# Altium schematic sheet robot-arm.SchDoc
size A; SheetNumber: 1; SheetTotal: 2
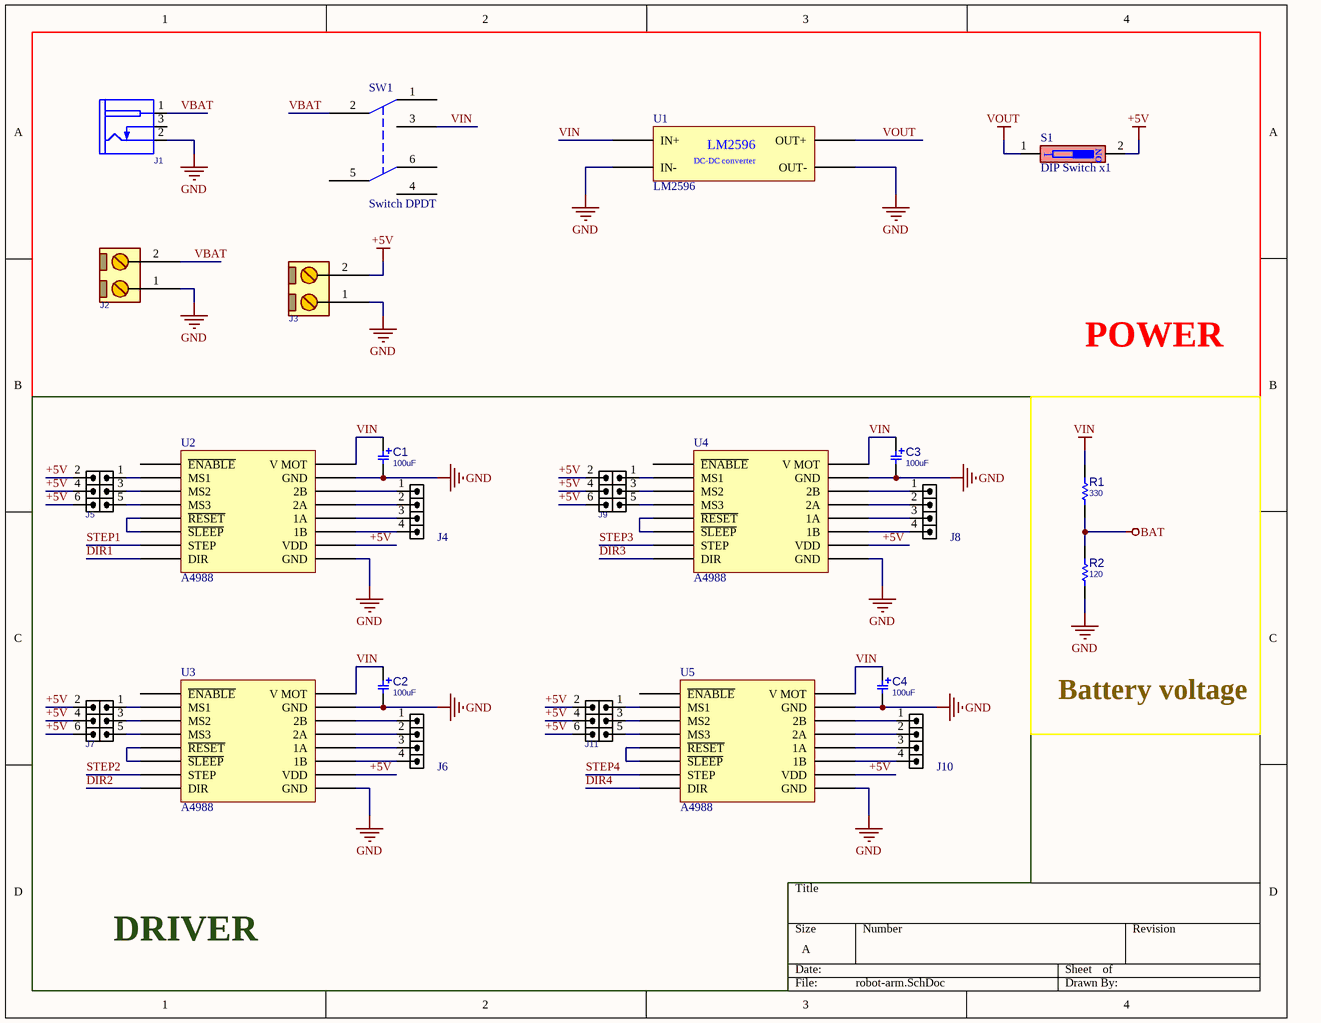
[diagram p0: robot-arm.SchDoc]

## Parts
C1  100uF  [C_EL_6X11]
C2  100uF  [C_EL_6X11]
C3  100uF  [C_EL_6X11]
C4  100uF  [C_EL_6X11]
J1  DC_POWER_JACK  [JAC_PWR2MM]  (value not drawn)
J2  CONN_TB2  [TBB_2]  (value not drawn)
J3  CONN_TB2  [TBB_2]  (value not drawn)
J4  HDR1X4  [HDR_M_1X4]  (value not drawn)
J5  HDRM_2X3  [HDR_M_2X3]  (value not drawn)
J6  HDR1X4  [HDR_M_1X4]  (value not drawn)
J7  HDRM_2X3  [HDR_M_2X3]  (value not drawn)
J8  HDR1X4  [HDR_M_1X4]  (value not drawn)
J9  HDRM_2X3  [HDR_M_2X3]  (value not drawn)
J10  HDR1X4  [HDR_M_1X4]  (value not drawn)
J11  HDRM_2X3  [HDR_M_2X3]  (value not drawn)
R1  330  [R025W_AX04]
R2  120  [R025W_AX04]
S1  DIP Switch x1  [DIP Switch x1]
SW1  Switch DPDT  [Switch DPDT]
U1  LM2596  [LM2596_MODULE]
U2  A4988  [DRIVER MOTOR_A4988]
U3  A4988  [DRIVER MOTOR_A4988]
U4  A4988  [DRIVER MOTOR_A4988]
U5  A4988  [DRIVER MOTOR_A4988]

## Blocks framed on the sheet
POWER: J1-J3 S1 SW1 U1
DRIVER: C1-C4 J4-J11 U2-U5
Battery voltage: R1 R2

## Nets
+5V: J3.2 J5.2 J5.4 J5.6 J7.2 J7.4 J7.6 J9.2 J9.4 J9.6 J11.2 J11.4 J11.6 S1.2 U2.10(VDD) U3.10(VDD) U4.10(VDD) U5.10(VDD)
BAT: R1.1 R2.2
GND: C1.2 C2.2 C3.2 C4.2 J1.2(SLEEVE) J2.1 J3.1 R2.1 U1.2(IN-) U1.3(OUT-) U2.9(GND) U2.15(GND) U3.9(GND) U3.15(GND) U4.9(GND) U4.15(GND) U5.9(GND) U5.15(GND)
VIN: C1.1 C2.1 C3.1 C4.1 R1.2 SW1.3 U1.1(IN+) U2.16(V_MOT) U3.16(V_MOT) U4.16(V_MOT) U5.16(V_MOT)
VOUT: S1.1 U1.4(OUT+)
DIR1: U2.8(DIR)
DIR2: U3.8(DIR)
DIR3: U4.8(DIR)
DIR4: U5.8(DIR)
STEP1: U2.7(STEP)
STEP2: U3.7(STEP)
STEP3: U4.7(STEP)
STEP4: U5.7(STEP)
VBAT: J1.1(TIP) J2.2 SW1.2
NetJ4_1: J4.1 U2.14(2B)
NetJ4_2: J4.2 U2.13(2A)
NetJ4_3: J4.3 U2.12(1A)
NetJ4_4: J4.4 U2.11(1B)
NetJ5_1: J5.1 U2.2(MS1)
NetJ5_3: J5.3 U2.3(MS2)
NetJ5_5: J5.5 U2.4(MS3)
NetJ6_1: J6.1 U3.14(2B)
NetJ6_2: J6.2 U3.13(2A)
NetJ6_3: J6.3 U3.12(1A)
NetJ6_4: J6.4 U3.11(1B)
NetJ7_1: J7.1 U3.2(MS1)
NetJ7_3: J7.3 U3.3(MS2)
NetJ7_5: J7.5 U3.4(MS3)
NetJ8_1: J8.1 U4.14(2B)
NetJ8_2: J8.2 U4.13(2A)
NetJ8_3: J8.3 U4.12(1A)
NetJ8_4: J8.4 U4.11(1B)
NetJ9_1: J9.1 U4.2(MS1)
NetJ9_3: J9.3 U4.3(MS2)
NetJ9_5: J9.5 U4.4(MS3)
NetJ10_1: J10.1 U5.14(2B)
NetJ10_2: J10.2 U5.13(2A)
NetJ10_3: J10.3 U5.12(1A)
NetJ10_4: J10.4 U5.11(1B)
NetJ11_1: J11.1 U5.2(MS1)
NetJ11_3: J11.3 U5.3(MS2)
NetJ11_5: J11.5 U5.4(MS3)
NetU2_5: U2.5(~{RESET}) U2.6(~{SLEEP})
NetU3_5: U3.5(~{RESET}) U3.6(~{SLEEP})
NetU4_5: U4.5(~{RESET}) U4.6(~{SLEEP})
NetU5_5: U5.5(~{RESET}) U5.6(~{SLEEP})

Not connected (* = marked no-connect by the designer): J1 3(INSERTION_DET); SW1 1 4 5 6; U2 1(~{ENABLE}); U3 1(~{ENABLE}); U4 1(~{ENABLE}); U5 1(~{ENABLE})

## Notes on the sheet
- (in symbol DIP Switch x1) ON

## Library data of the parts
C1-C4 = CAP_THD_EL: CAP, THD, ELEC,; MANF_P#: MANF_PART#; PARAM2: 20%; DESC: DESCRIPTION; DIST#: MOUSER; PARAM: 25V; PRICE: 10= 5$; MANF: MANF; ASSEMBLY: ASSEMBLY; VALUE: 100uF
J1 = CONN_PWR_JACK2MM: CONN, PWR JACK DC, PLUG DIAM 2.0MM RA THD; MANF: CUI STACK; MANF_P#: PJ-202A, PJ-002AH, PJ-102AH, KLDX-0202; VALUE: DC_POWER_JACK
J2 J3 = CONN_TB2: CONN, TERMINAL BLOCK, 5.08mm pitch; VALUE: CONN_TB2
J4 J6 J8 J10 = HDR_M_1X4: CONN, HEADER, Male, pitch: 2.54mm, 4POS; VALUE: HDRM4
J5 J7 J9 J11 = HDR_M_2X3: CONN, HEADER, Male, pitch: 2.54mm, 6POS; MANF_P#: MANF_PART#; MANF: MANF; VALUE: HDRM_2X3
R1 R2 = RES_THD: RESISTOR, THD; MANF_P#: RK73H1ETTP4701F; MANF: KOA SPEER; PARAM: 0.063W; DESC: DESCRIPTION; DIST#: MOUSER; PARAM2: 1%; ASSEMBLY: ASSEMBLY; PRICE: 100= 0.5$
  R1: VALUE: 330
  R2: VALUE: 120
U1 = LM2596_ADJ: DC-DC converter
U2-U5 = A4988: Driver stepper motor